# EasyEDA Pro project esp32-expander_2026-01-10.epro

# Schematic Schematic1
Board Name: Board1; Create Date: 2025-12-13; Page Name: P1; Project Name: ESP32 Expander; Schematic Name: Schematic1; Update Date: 2026-01-10; Company: EasyEDA.com; Page Size: A4; Version: V1.0
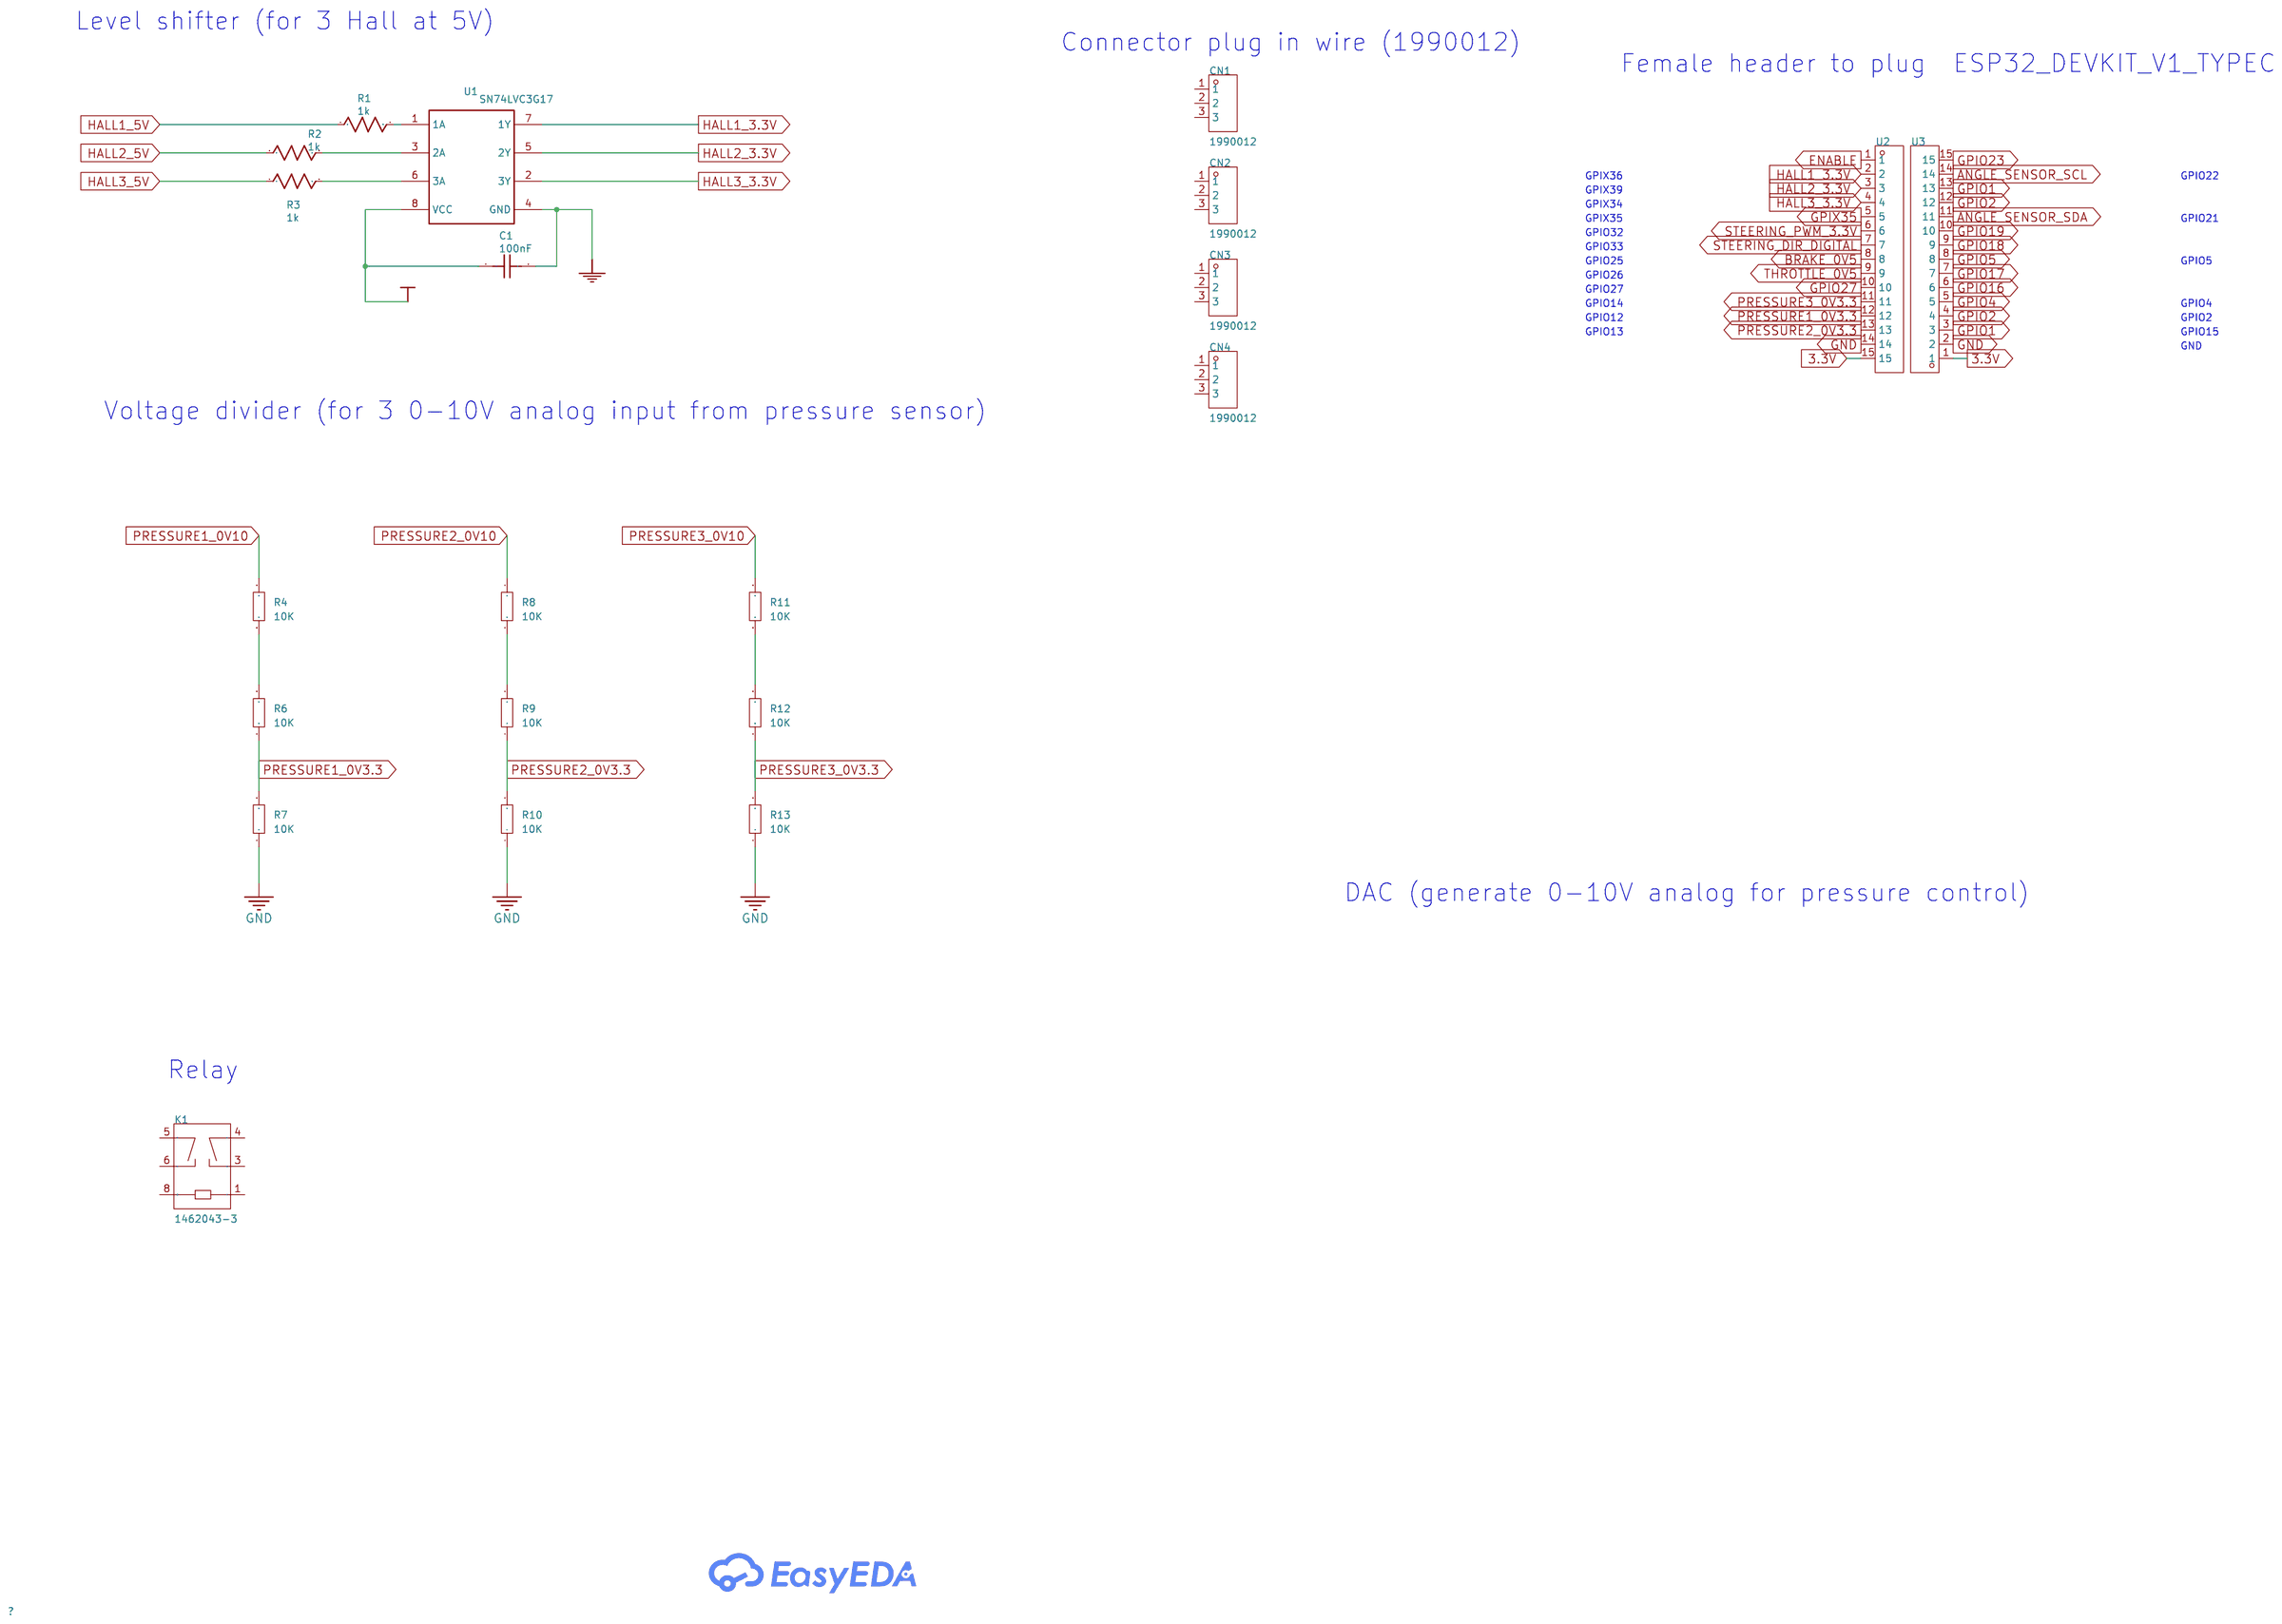
[diagram p0: schematic sheet]

## Parts
C1  100nF  [C0603]
CN1  1990012  [CONN-TH_3P-P2.50-S5.00_1990012]
CN2  1990012  [CONN-TH_3P-P2.50-S5.00_1990012]
CN3  1990012  [CONN-TH_3P-P2.50-S5.00_1990012]
CN4  1990012  [CONN-TH_3P-P2.50-S5.00_1990012]
K1  1462043-3  [RELAY-SMD_1462043-3]
R1  1k  [R0603]
R2  1k  [R0603]
R3  1k  [R0603]
R4  10K  [R0603]
R6  10K  [R0603]
R7  10K  [R0603]
R8  10K  [R0603]
R9  10K  [R0603]
R10  10K  [R0603]
R11  10K  [R0603]
R12  10K  [R0603]
R13  10K  [R0603]
U1  SN74LVC3G17  [VSSOP-8_L3.0-W3.0-P0.65-LS5.0-BL]
U2  ZX-PM2.54-1-15PY  [HDR-TH_15P-P2.54-V-F]
U3  ZX-PM2.54-1-15PY  [HDR-TH_15P-P2.54-V-F]

## Library data of the parts
C1 = 100nF: nameAlias: Value(F); Contributor: LCEDA_Lib; spicePre: C; spiceSymbolName: C_0603_US
CN1-CN4 = 1990012: Supplier Part: C9900080101; Supplier Footprint: 3P; Supplier: LCSC
K1 = 1462043-3: Coil Voltage:5V Contact Form:Two groups normally open: 2A (double pole single throw - normally open) Number of Pins:- Contact Rating:- Switching Voltage(Max):250V@AC；220V@DC Contact Material:- Coil Resistance:- Switching Current(Max):2A Operate Time:3ms R; LCSC Part Name: 无锁存 5VDC 2A 无锁存; Supplier Part: C2153096; Manufacturer: TE Connectivity(泰科电子); JLCPCB Part Class: Extended Part; Datasheet: https://item.szlcsc.com/datasheet/1462043-3/2245144.html; Supplier: LCSC; Coil Voltage: 5V; Contact Form: Two groups normally open: 2A (double pole single throw - normally open); Switching Voltage(Max): 250V@AC；220V@DC; Switching Current(Max): 2A; Operate Time: 3ms; Release Time: 3ms; Operating Temperature: -40℃~+85℃
R1-R3 = 1k: nameAlias: Value(Ω); Contributor: LCEDA_Lib; spicePre: R; spiceSymbolName: R_0603_US
R4 R6-R13 = Res_0603: Supplier Footprint: 0603
U1 = SN74LVC3G17: Manufacturer: Texas Instruments; Manufacturer Part: SN74LVC3G17DCUR; Supplier: Digi-Key; Supplier Part: 296-18818-1-ND; Contributor: bradyriddle; spicePre: U
U2 U3 = ZX-PM2.54-1-15PY: Holes Structure:1x15P Pitch:2.54mm Row Spacing:- Circular Hole / Square Hole:Square Hole Mounting Type:Through Hole Number of Rows:1 Number of Positions:15P Current Rating:3A Voltage Rating (Max):- Holes Direction:Top Insulation Height:8.5mm Contact Mater; LCSC Part Name: 1x15P 间距:2.54mm 直插; Supplier Part: C7499333; Manufacturer: Megastar(兆星); Supplier Footprint: 插件,P=2.54mm; JLCPCB Part Class: Extended Part; Datasheet: https://item.szlcsc.com/datasheet/ZX-PM2.54-1-15PY/8573994.html; Supplier: LCSC; Holes Structure: 1x15P; Pitch: 2.54mm; Circular Hole / Square Hole: Square Hole; Mounting Type: Through Hole; Number of Rows: 1; Number of Positions: 15P; Current Rating: 3A; Holes Direction: Top; Insulation Height: 8.5mm; Contact Material: Brass; Contact Plating: Gold; Operating Temperature: -40℃~+105℃; PIN Length: 3.2mm

## Nets
3.3V: U2.15 U3.1
+3.3V: C1.1 U1.8(VCC)
GND: C1.2 R7.1 R10.1 R13.1 U1.4(GND) U2.14 U3.2
ANGLE_SENSOR_SCL: U3.14
ANGLE_SENSOR_SDA: U3.11
BRAKE_0V5: U2.8
ENABLE: U2.1
GPIO1: U3.3 U3.13
GPIO2: U3.4 U3.12
GPIO4: U3.5
GPIO5: U3.8
GPIO16: U3.6
GPIO17: U3.7
GPIO18: U3.9
GPIO19: U3.10
GPIO23: U3.15
GPIO27: U2.10
GPIX35: U2.5
HALL1_3.3V: U1.7(1Y) U2.2
HALL1_5V: R1.1
HALL2_3.3V: U1.5(2Y) U2.3
HALL2_5V: R2.1
HALL3_3.3V: U1.2(3Y) U2.4
HALL3_5V: R3.1
PRESSURE1_0V3.3: R6.1 R7.2 U2.12
PRESSURE1_0V10: R4.1
PRESSURE2_0V3.3: R9.1 R10.2 U2.13
PRESSURE2_0V10: R8.1
PRESSURE3_0V3.3: R12.1 R13.2 U2.11
PRESSURE3_0V10: R11.1
STEERING_DIR_DIGITAL: U2.7
STEERING_PWM_3.3V: U2.6
THROTTLE_0V5: U2.9
$1N247: R1.2 U1.1(1A)
$1N249: R2.2 U1.3(2A)
$1N250: R3.2 U1.6(3A)
$1N1811: R4.2 R6.2
$1N3081: R8.2 R9.2
$1N3199: R11.2 R12.2

Not connected (* = marked no-connect by the designer): CN1 1 2 3; CN2 1 2 3; CN3 1 2 3; CN4 1 2 3; K1 1 3 4 5 6 8

## Notes on the sheet
- Level shifter (for 3 Hall at 5V)
- Connector plug in wire (1990012)
- Female header to plug  ESP32_DEVKIT_V1_TYPEC
- GPIX36
- GPIO22
- GPIX39
- GPIX34
- GPIX35
- GPIO21
- GPIO32
- GPIO33
- GPIO25
- GPIO5
- GPIO26
- GPIO27
- GPIO14
- GPIO4
- GPIO12
- GPIO13
- GPIO15
- GPIO2
- GND
- Voltage divider (for 3 0-10V analog input from pressure sensor)
- DAC (generate 0-10V analog for pressure control)
- Relay

# Board PCB1
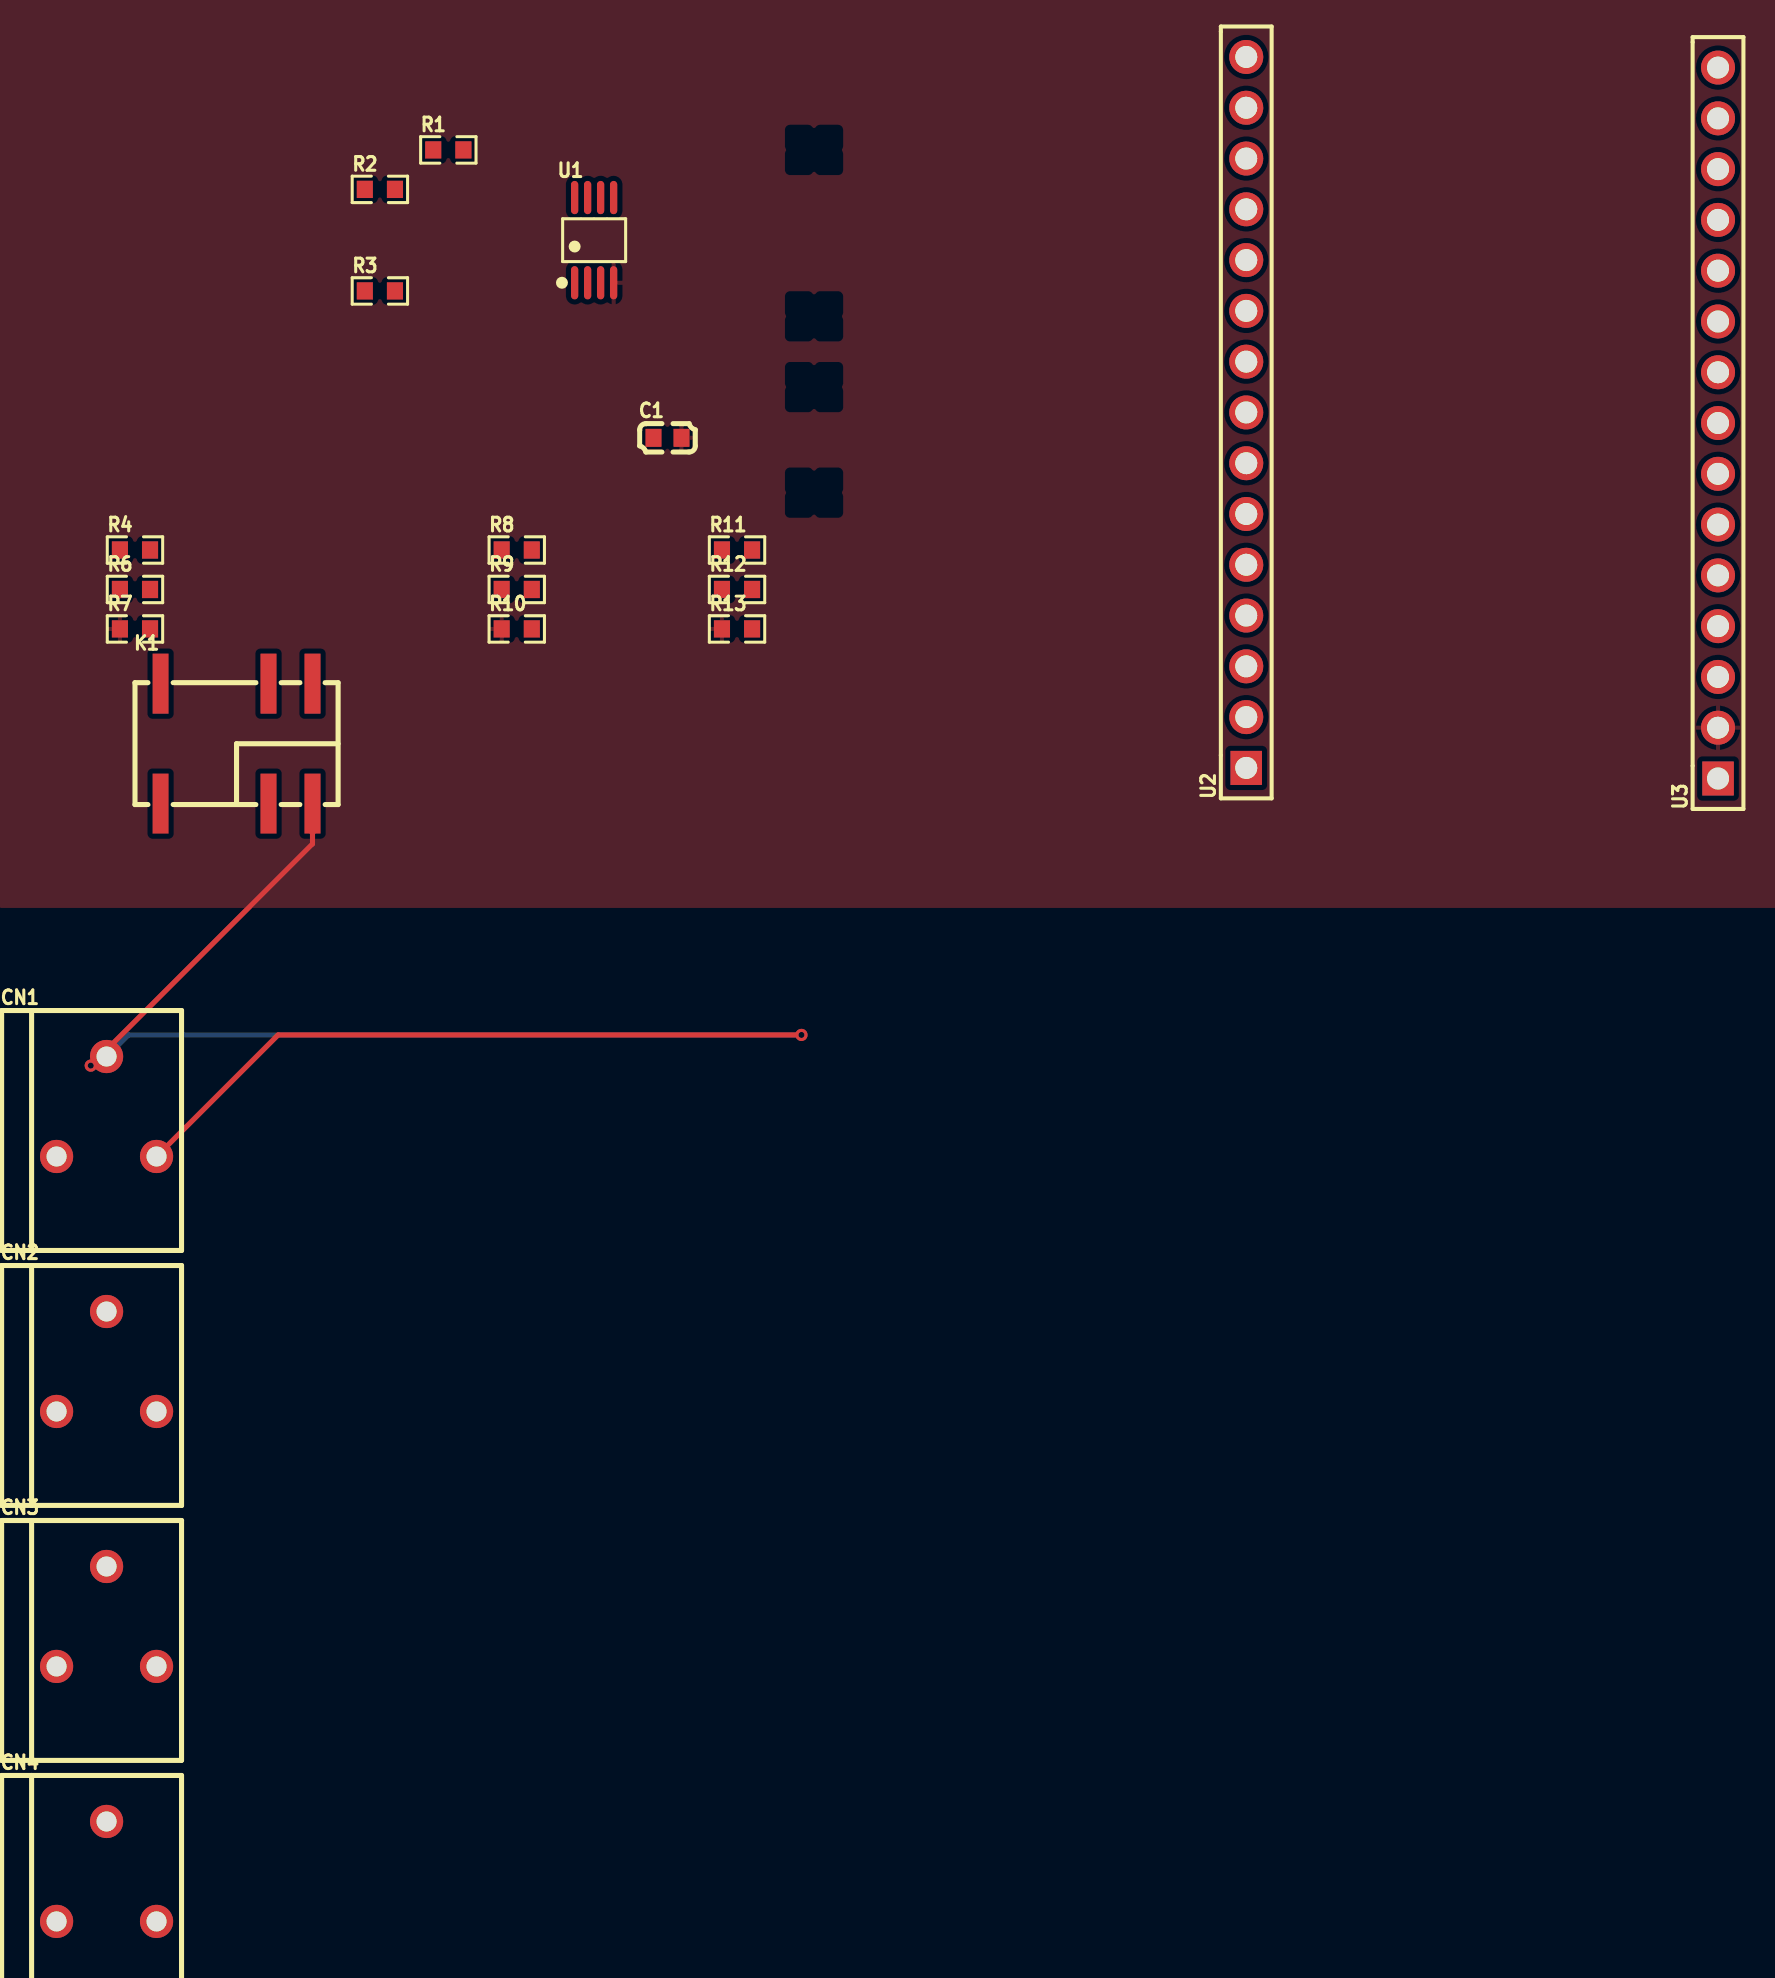
[diagram p1: board, top side]
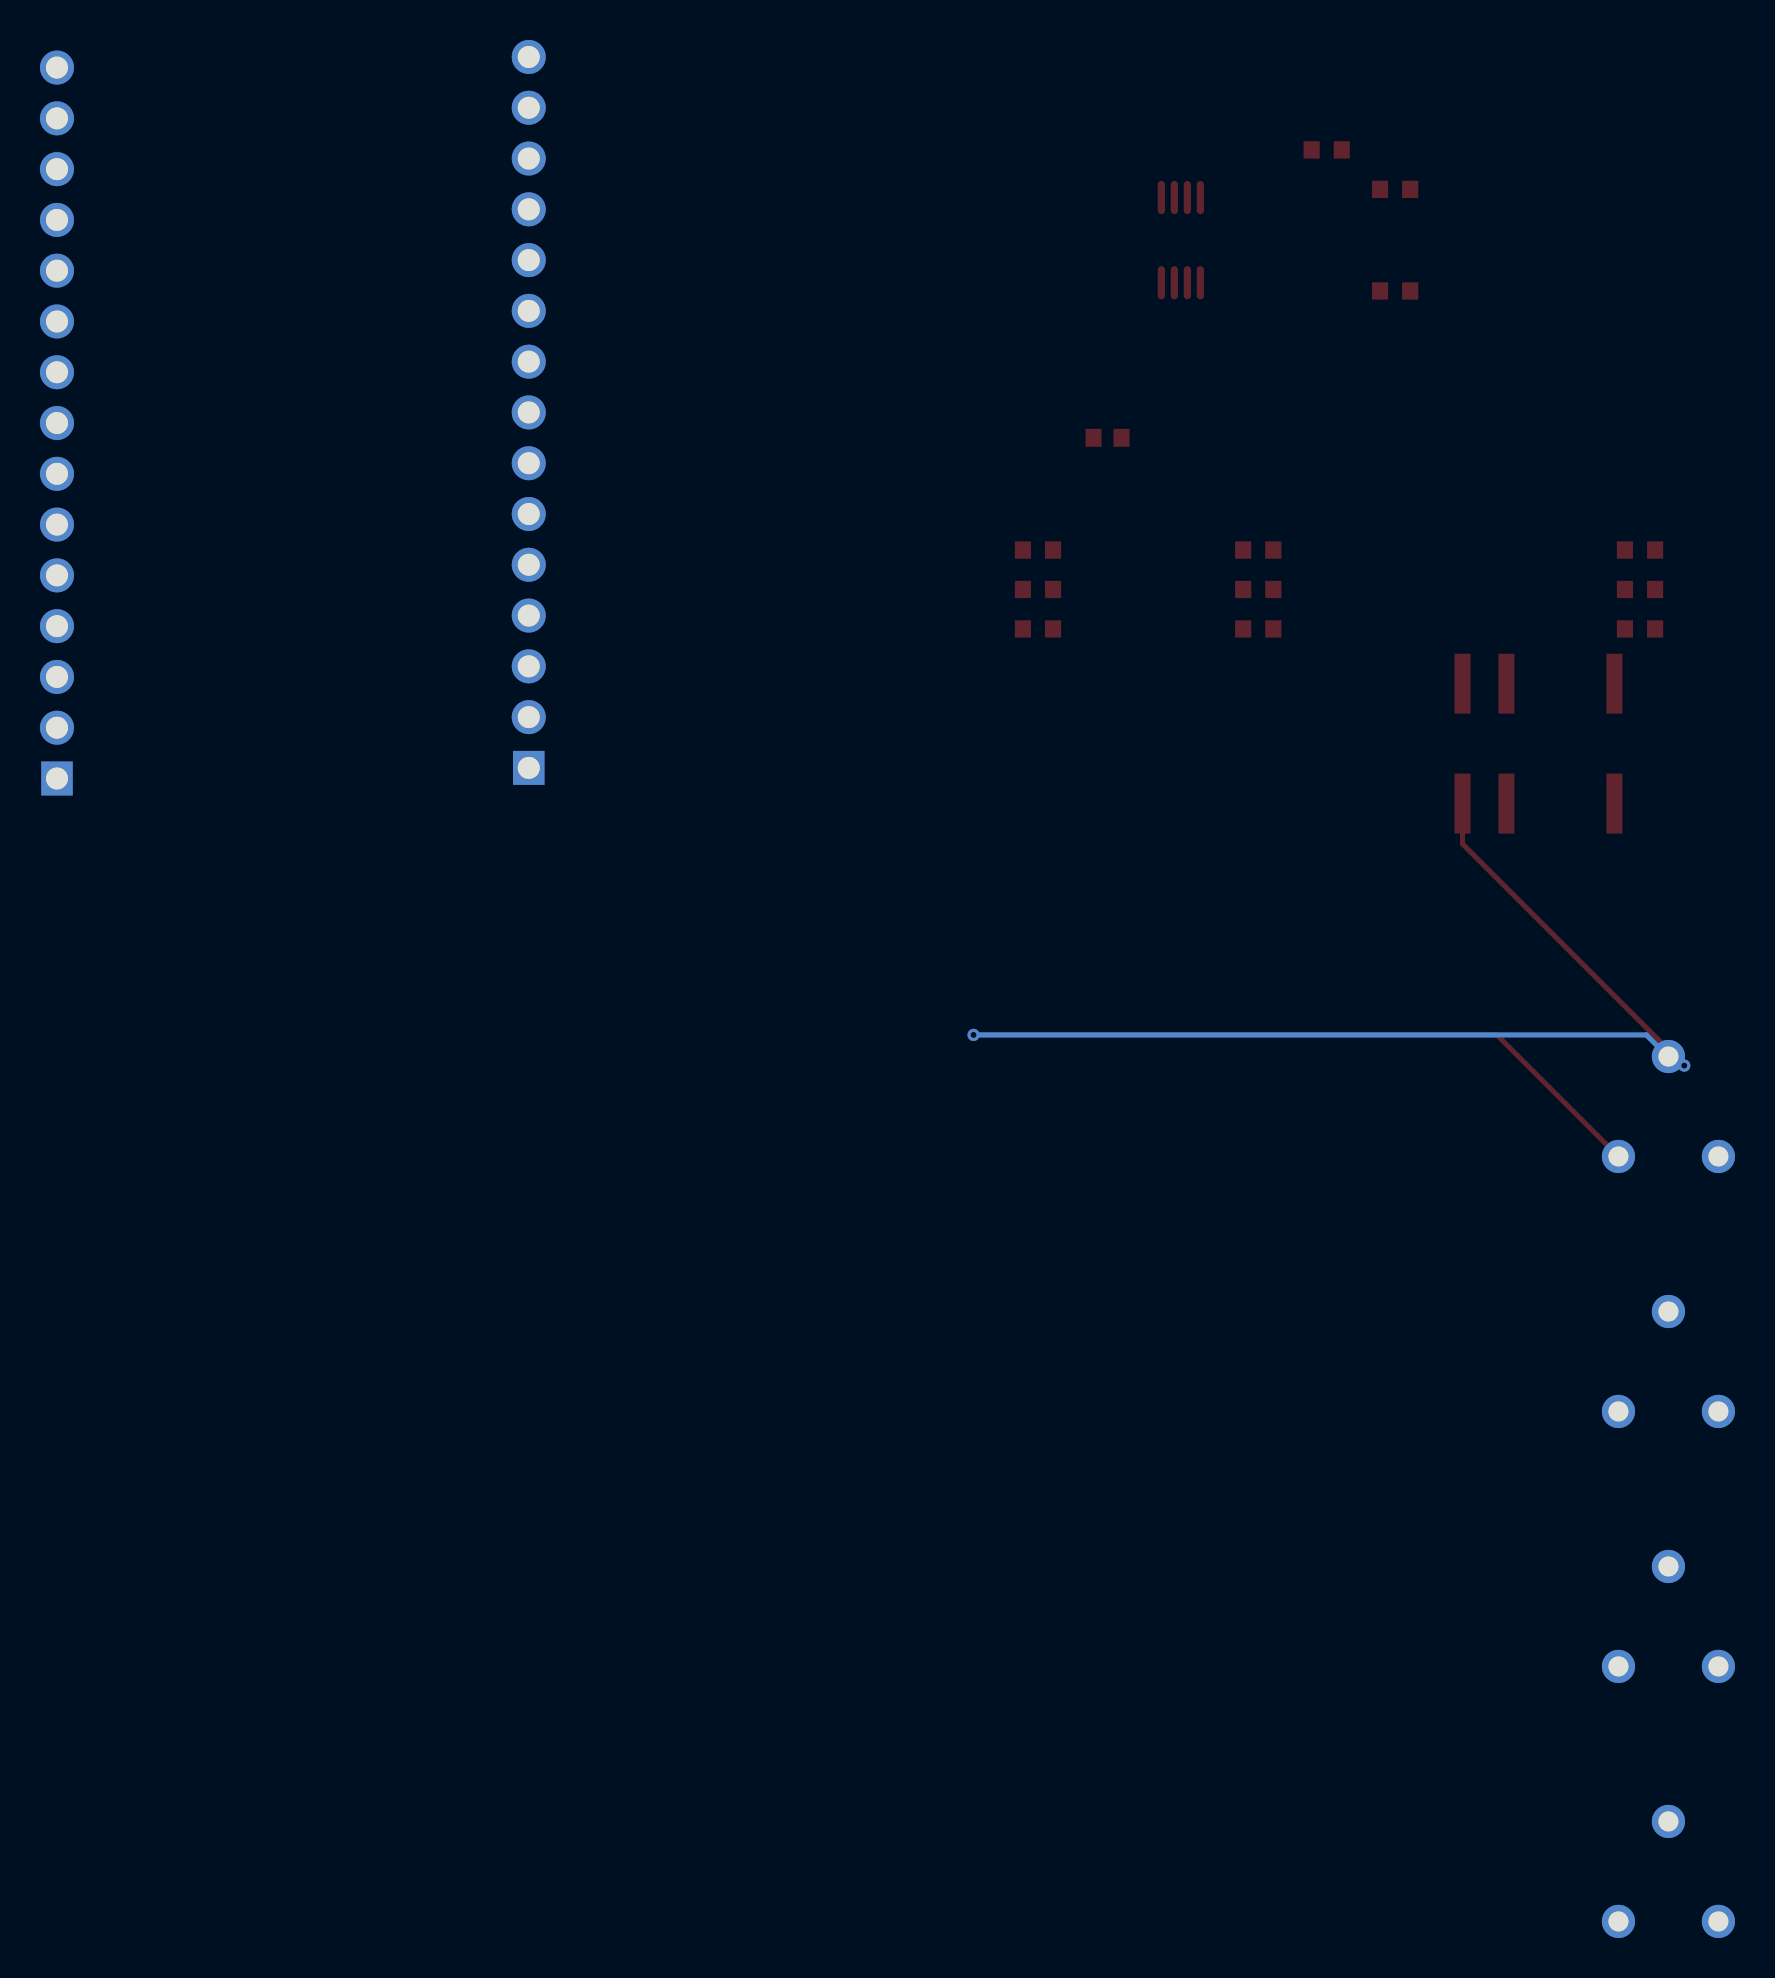
[diagram p2: board, bottom side, seen from below]

No outline. copper layers: Top Layer, Bottom Layer. Coordinates in mm from the lowest, leftmost part position.
Stack: Top Layer 0.035mm / Dielectric1 1.51mm FR4 er 4.5 / Bottom Layer 0.035mm

## Design rules (mm)
template: JLCPCB Capability(Two Layers Board)
spacing copperThickness1oz (default): track to track 0.102, other pairs 0.152 to 0.3
spacing copperThickness2oz: track to track 0.203, other pairs 0.152 to 0.3
track width copperThickness1oz (default): min 0.127, default 0.254, max 2.54
track width copperThickness2oz: min 0.203, default 0.254, max 2.54
differential pair differentialPair (default): width min 0.127, default 0.254, max 2.54; gap min 0.152, default 0.152
via viaSize (default): diameter min 0.5, default 0.61, max 10; hole min 0.3, default 0.305, max 6.3

## Placement (name value [footprint] x y rotation side)
C1  100nF  [C0603]  28.06 71.71 0 top
CN1  1990012  [CONN-TH_3P-P2.50-S5.00_1990012]  0 38.26 0 top
CN2  1990012  [CONN-TH_3P-P2.50-S5.00_1990012]  0 25.51 0 top
CN3  1990012  [CONN-TH_3P-P2.50-S5.00_1990012]  0 12.75 0 top
CN4  1990012  [CONN-TH_3P-P2.50-S5.00_1990012]  0 0 0 top
K1  1462043-3  [RELAY-SMD_1462043-3]  6.5 56.41 0 top
R1  1k  [R0603]  17.09 86.11 0 top
R2  1k  [R0603]  13.67 84.14 0 top
R3  1k  [R0603]  13.67 79.06 0 top
R4  10K  [R0603]  1.42 66.1 0 top
R6  10K  [R0603]  1.42 64.12 0 top
R7  10K  [R0603]  1.42 62.15 0 top
R8  10K  [R0603]  20.52 66.1 0 top
R9  10K  [R0603]  20.52 64.12 0 top
R10  10K  [R0603]  20.52 62.15 0 top
R11  10K  [R0603]  31.53 66.1 0 top
R12  10K  [R0603]  31.53 64.12 0 top
R13  10K  [R0603]  31.53 62.15 0 top
U1  SN74LVC3G17  [VSSOP-8_L3.0-W3.0-P0.65-LS5.0-BL]  24.39 81.6 0 top
U2  ZX-PM2.54-1-15PY  [HDR-TH_15P-P2.54-V-F]  57.01 72.98 90 top
U3  ZX-PM2.54-1-15PY  [HDR-TH_15P-P2.54-V-F]  80.6 72.45 90 top

## Footprints (pads in the part's own frame, mm; a bottom-side part is the same pattern mirrored in y, then rotated)
C0603
  rect 0.8x0.9 smd: 1(-0.7,0) 2(0.7,0)
CONN-TH_3P-P2.50-S5.00_1990012
  round 1.66 hole 1: 1(-2.5,-2.5) 2(0,2.5) 3(2.5,-2.5)
HDR-TH_15P-P2.54-V-F
  rect 1.7x1.575 hole 1.1: 1(-17.78,0)
  round 1.7 hole 1.1: 2(-15.24,0) 3(-12.7,0) 4(-10.16,0) 5(-7.62,0) 6(-5.08,0) 7(-2.54,0) 8(0,0) 9(2.54,0) 10(5.08,0) 11(7.62,0) 12(10.16,0) 13(12.7,0) 14(15.24,0) 15(17.78,0)
R0603
  rect 0.806x0.864 smd: 1(-0.753,0) 2(0.753,0)
RELAY-SMD_1462043-3
  rect 0.8x3 smd: 1(-3.8,-3) 3(1.6,-3) 4(3.8,-3) 5(3.8,3) 6(1.6,3) 8(-3.8,3)
VSSOP-8_L3.0-W3.0-P0.65-LS5.0-BL
  oval 0.364x1.662 smd: 1(-0.975,-2.131) 2(-0.325,-2.131) 3(0.325,-2.131) 4(0.975,-2.131) 5(0.975,2.131) 6(0.325,2.131) 7(-0.325,2.131) 8(-0.975,2.131)

## Nets
3.3V: U3.1
+3.3V: C1.1 U1.8
GND: C1.2 R7.1 R10.1 R13.1 U1.4 U3.2
ANGLE_SENSOR_SCL: U3.14
ANGLE_SENSOR_SDA: U3.11
GPIO1: U3.3 U3.13
GPIO2: U3.4 U3.12
GPIO4: U3.5
GPIO5: U3.8
GPIO16: U3.6
GPIO17: U3.7
GPIO18: U3.9
GPIO19: U3.10
GPIO23: U3.15
HALL1_3.3V: U1.7
HALL1_5V: R1.1
HALL2_3.3V: U1.5
HALL2_5V: R2.1
HALL3_3.3V: U1.2
HALL3_5V: R3.1
PRESSURE1_0V3.3: R6.1 R7.2
PRESSURE1_0V10: R4.1
PRESSURE2_0V3.3: R9.1 R10.2
PRESSURE2_0V10: R8.1
PRESSURE3_0V3.3: R12.1 R13.2
PRESSURE3_0V10: R11.1
$1N247: R1.2 U1.1
$1N249: R2.2 U1.3
$1N250: R3.2 U1.6
$1N1811: R4.2 R6.2
$1N3081: R8.2 R9.2
$1N3199: R11.2 R12.2

Pads without a net: CN1 1 2 3; CN2 1 2 3; CN3 1 2 3; CN4 1 2 3; K1 1 3 4 5 6 8; U2 1 2 3 4 5 6 7 8 9 10 11 12 13 14 15

## Via types
v1: diameter 0.61, hole 0.305, Top Layer to Bottom Layer, 2 vias

## Routing (per net, layer and track width the routed paths; a pad name or vN(x,y) marks a point on that pad's centre or on a via; arc(x,y) is an arc through that point)
(no net): length 88.7
  Top Layer w0.254: v1(34.76,41.84) 8.58,41.84 CN1.3 ; v1(-0.79,40.31) 10.3,51.4 10.3,53.41
  Bottom Layer w0.254: v1(34.76,41.84) 1.1,41.84 -0.49,40.25 -0.74,40.25 v1(-0.79,40.31)

## Copper pours and planes (outline as drawn; the poured copper is in the pictures)
GND on Top Layer: -5.37,95.56 86.95,95.56 86.95,48.19 -5.37,48.19
